# EAGLE schematic ghettoduino (EAGLE 6.0)
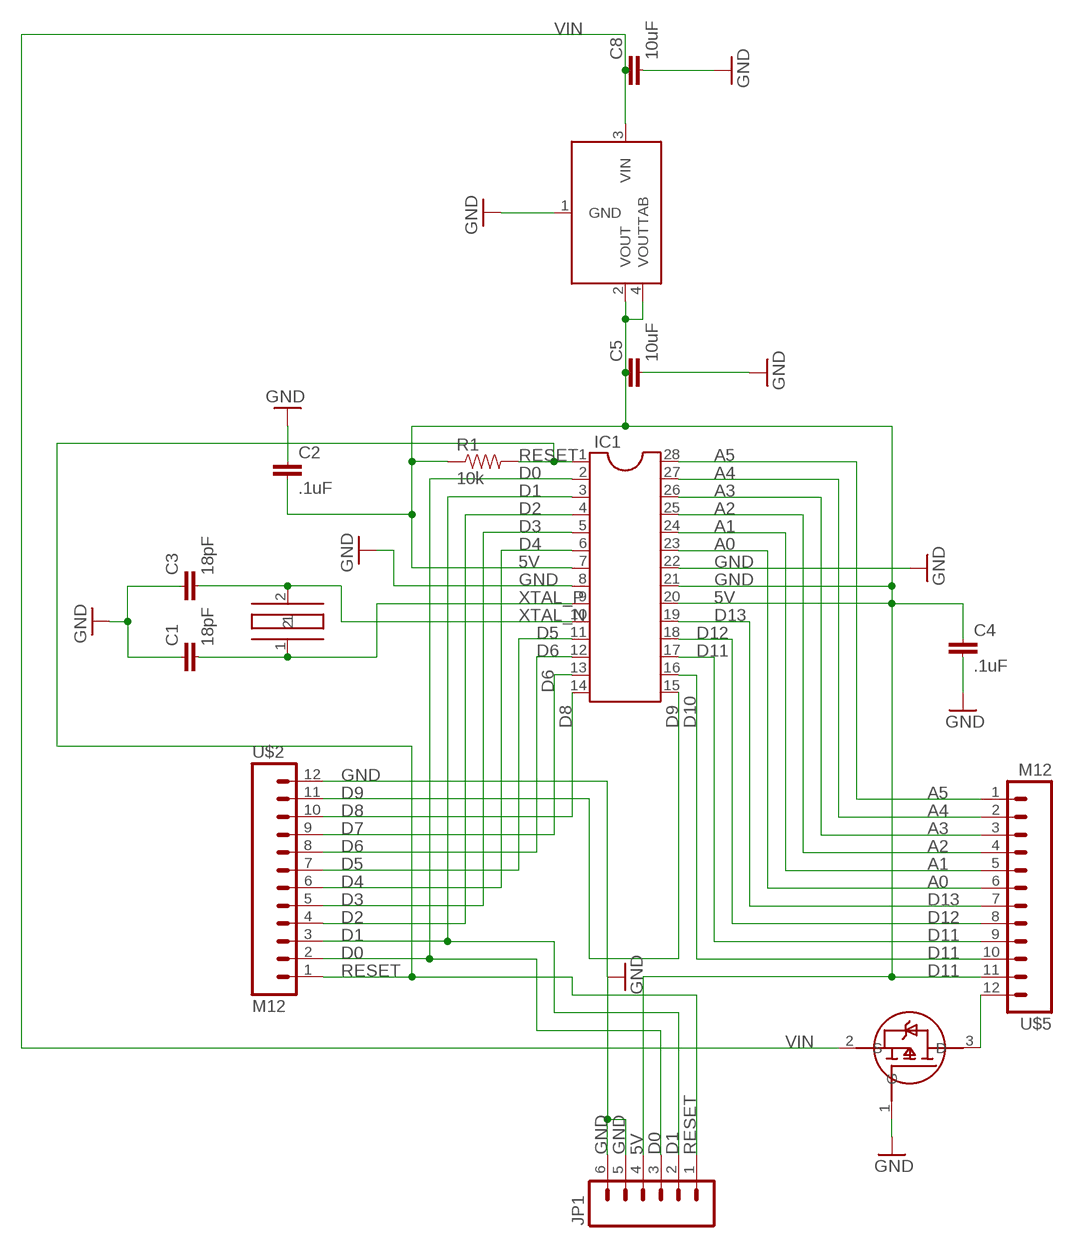
[diagram p0: schematic, sheet 1]

## Parts
5V  5V-LDO-ZLDO1117  [ZLDO1117]
C1  18pF  CAP0603-CAP  [0603-CAP]
C2  .1uF  CAP0805  [0805]
C3  18pF  CAP0603-CAP  [0603-CAP]
C4  .1uF  CAP0805  [0805]
C5  10uF  CAP1206  [1206]
C8  10uF  CAP1206  [1206]
IC1  DIL28-3  [DIL28-3]
JP1  M06LOCK  [1X06_LOCK]
R1  10k  RESISTOR  [0805]
U$1  HC49US  [HC49US]
U$2  M12  M12LOCK  [1X12_LOCK]
U$3  P-MOSFET-PMV48XP  [SOT23-3LEAD]
U$5  M12  M12LOCK  [1X12_LOCK]

## Nets
5V: 5V.2(VOUT) 5V.4(VOUTTAB) C2.2 C4.1 C5.1 IC1.7 IC1.20 IC1.21 JP1.4 R1.1 U$5.11
A0: IC1.23 U$5.6
A1: IC1.24 U$5.5
A2: IC1.25 U$5.4
A3: IC1.26 U$5.3
A4: IC1.27 U$5.2
A5: IC1.28 U$5.1
D0: IC1.2 JP1.3 U$2.2
D1: IC1.3 JP1.2 U$2.3
D2: IC1.4 U$2.4
D3: IC1.5 U$2.5
D4: IC1.6 U$2.6
D5: IC1.11 U$2.7
D6: IC1.12 U$2.8
D7: IC1.13 U$2.9
D8: IC1.14 U$2.10
D9: IC1.15 U$2.11
D10: IC1.16 U$5.10
D11: IC1.17 U$5.9
D12: IC1.18 U$5.8
D13: IC1.19 U$5.7
GND: 5V.1(GND) C1.1 C2.1 C3.1 C4.2 C5.2 C8.2 IC1.8 IC1.22 JP1.5 JP1.6 U$2.12 U$3.1(G)
N$1: U$3.3(D) U$5.12
RESET: IC1.1 JP1.1 R1.2 U$2.1
VIN: 5V.3(VIN) C8.1 U$3.2(S)
XTAL_N: C3.2 IC1.10 U$1.2
XTAL_P: C1.2 IC1.9 U$1.1

## Library data of the parts
5V = 1dah:5V-LDO: 5 V LDO, 12V input, 1 A
C1-C5 C8 = 1dah:CAP: Capacitor Standard 0402 ceramic capacitor, and 0.1" leaded capacitor.
IC1 = 1dah:DIL28: Dual In Line
JP1 = 1dah:M06: Header 6 Standard 6-pin 0.1" header. Use with straight break away headers (SKU : PRT-00116), right angle break away headers (PRT-00553), swiss pins (PRT-00743), machine pins (PRT-00117), and female headers (PRT-00115). Molex polarized connector foot print use with SKU : PRT-08094 with associated crimp pins and housings. NOTES ON THE VARIANTS LOCK and LOCK_LONGPADS... This footprint was designed to help hold the alignment of a through-hole component (i.e. 6-pin header) while soldering it into place. You may notice that each hole has been shifted either up or down by 0.005 of an inch from it's more standard position (which is a perfectly straight line). This slight alteration caused the pins (the squares in the middle) to touch the edges of the holes. Because they are alternating, it causes a "brace" to hold the component in place. 0.005 has proven to be the perfect amount of "off-center" position when using our standard breakaway headers. Although looks a little odd when you look at the bare footprint, once you have a header in there, the alteration is very hard to notice. Also, if you push a header all the way into place, it is covered up entirely on the bottom side. This idea of altering the position of holes to aid alignment will be further integrated into the Sparkfun Library for other footprints. It can help hold any component with 3 or more connection pins.
R1 = 1dah:RESISTOR: Resistor Basic schematic elements and footprints for 0603, 1206, and PTH 1/10th watt (small) resistors.
U$1 = 1dah:HC49US: 16 MHz crystal
U$2 U$5 = 1dah:M12: Header 12 Standard 12-pin 0.1" header. Use with straight break away headers (SKU : PRT-00116), right angle break away headers (PRT-00553), swiss pins (PRT-00743), machine pins (PRT-00117), and female headers (PRT-00115).
U$3 = 1dah:P-MOSFET